# EAGLE design CoolRoof_Terminal_exterieur (EAGLE 9.5.2)
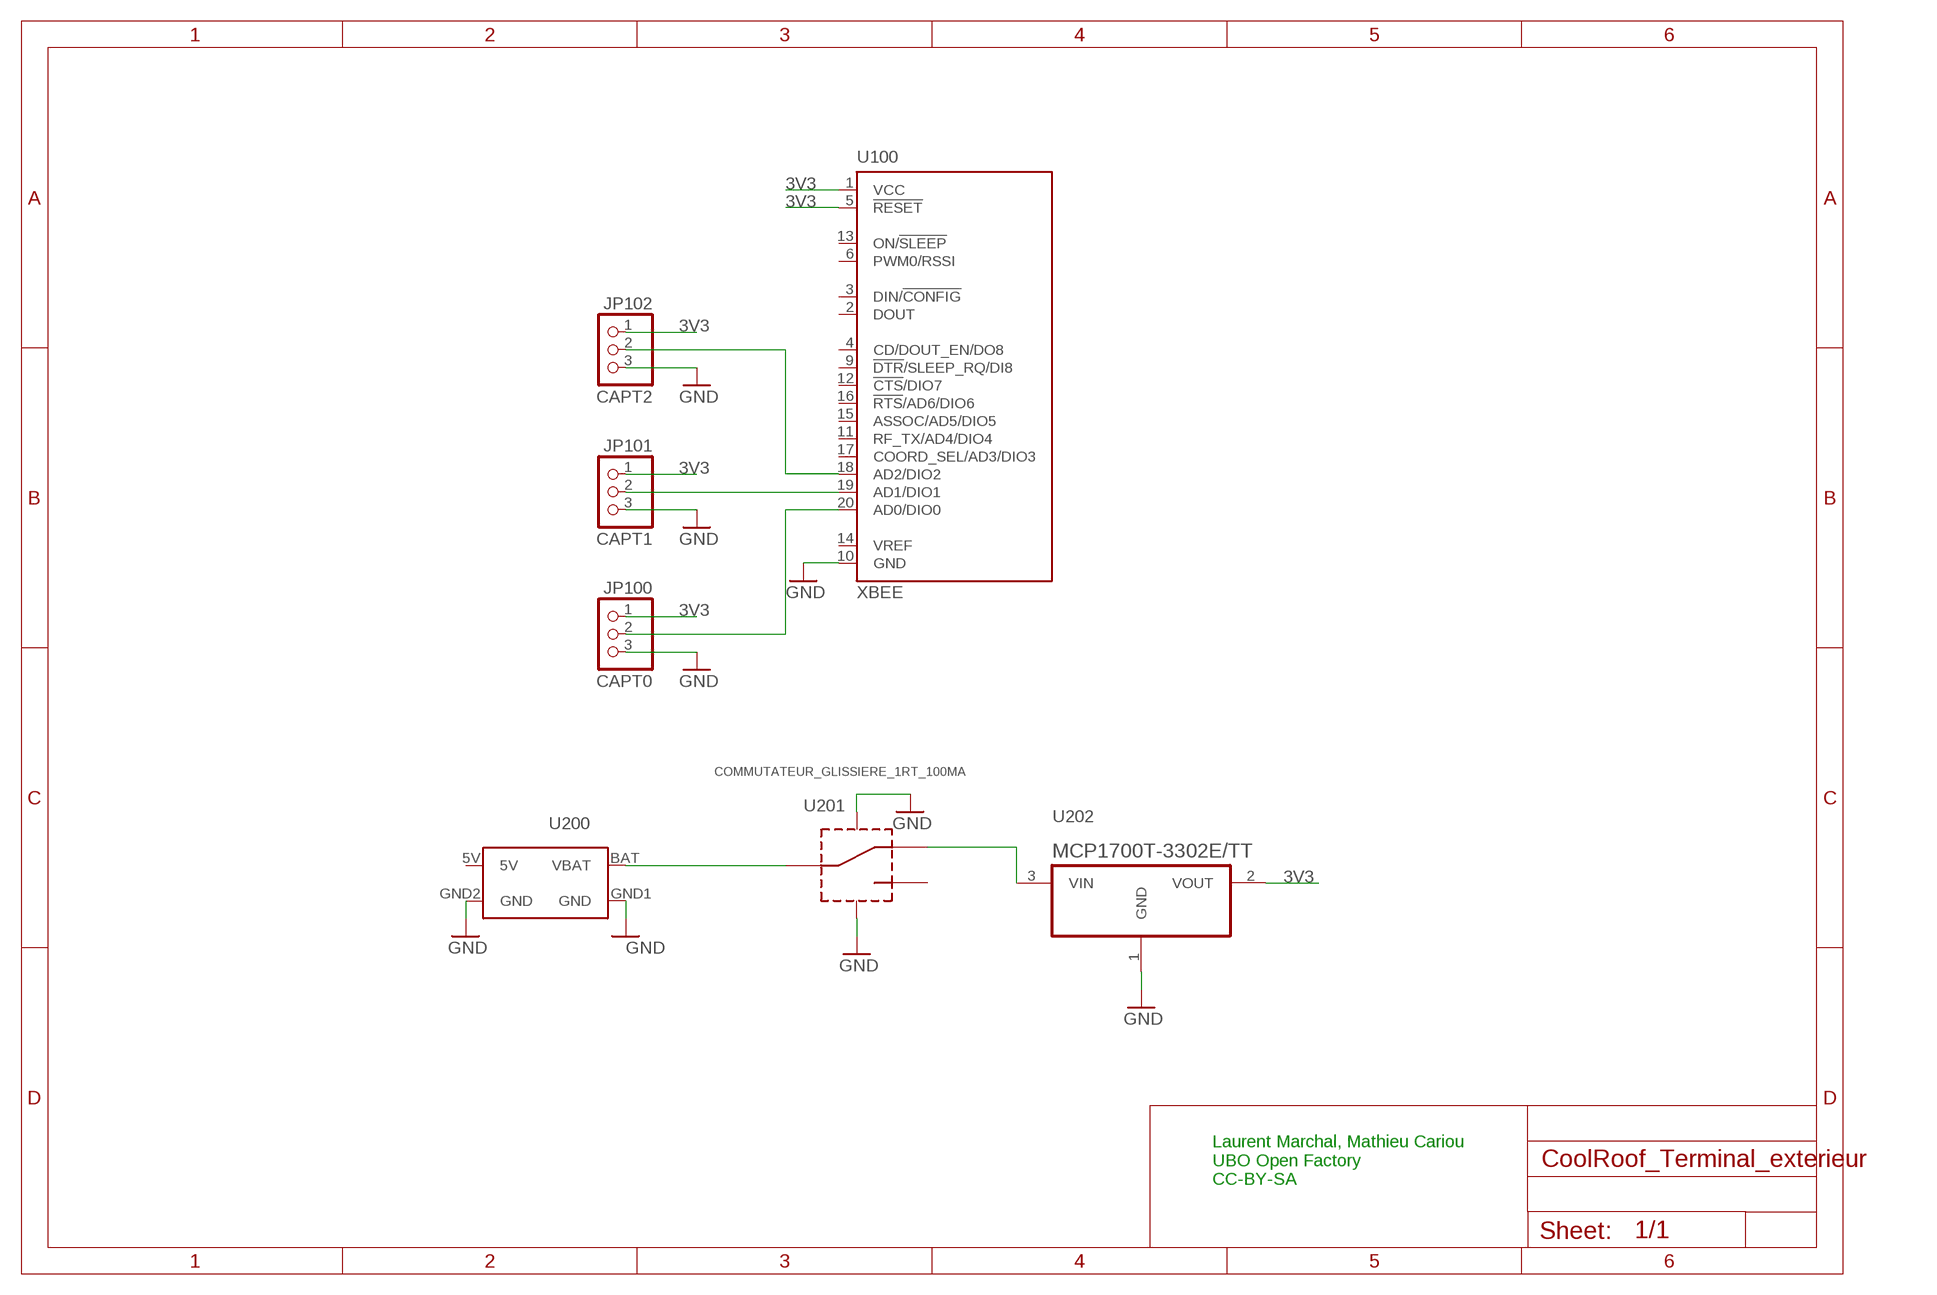
[diagram p0: schematic, sheet 1]

## Parts
JP100  CAPT0  PINHD-1X3  [1X03]
JP101  CAPT1  PINHD-1X3  [1X03]
JP102  CAPT2  PINHD-1X3  [1X03]
U100  XBEE  [XBEE]
U200  MICROUSB-LIPO-CHARGEUR-ADAFRUITMICRO-USB-CHARGEUR  [MICROUSB-LIPO-CHARGEUR-ADAFRUIT]
U201  COMMUTATEUR_GLISSIERE_1RT_100MA  [COMMUTATEUR_GLISSIERE_1RT_100MA]
U202  MCP1700T-3302E/TT  [SOT95P237X112-3N]

## Nets
3V3: JP100.1 JP101.1 JP102.1 U100.1(VCC) U100.5(!RESET) U202.2(VOUT)
GND: JP100.3 JP101.3 JP102.3 U100.10(GND) U200.GND1(GND) U200.GND2(GND) U201.GNDA U201.GNDB U202.1(GND)
N$1: JP100.2 U100.20(AD0/DIO0)
N$2: U200.BAT(VBAT) U201.COM
N$3: U201.OUTB(OUT2) U202.3(VIN)
N$7: JP101.2 U100.19(AD1/DIO1)
N$9: JP102.2 U100.18(AD2/DIO2)
Unconnected: U100.2(DOUT) U100.3(DIN/!CONFIG) U100.4(CD/DOUT_EN/DO8) U100.6(PWM0/RSSI) U100.9(!DTR!/SLEEP_RQ/DI8) U100.11(RF_TX/AD4/DIO4) U100.12(!CTS!/DIO7) U100.13(ON/!SLEEP) U100.14(VREF) U100.15(ASSOC/AD5/DIO5) U100.16(!RTS!/AD6/DIO6) U100.17(COORD_SEL/AD3/DIO3) U200.5V U201.OUTA(OUT1)

## Notes on the sheet
- Laurent Marchal, Mathieu Cariou
  UBO Open Factory
  CC-BY-SA

## Library data of the parts
JP100-JP102 = pinhead:PINHD-1X3: PIN HEADER
U100 = Eagle_UOF_Lib:XBEE: XBee (TM) /XBee-PRO(TM) OEM RF Modules Source: MaxStream, Inc. xbee_productmanual.pdf; MPN: XBP24-Z7UIT-004; OC_FARNELL: 1751799; OC_NEWARK: 34R5507
U200 = Eagle_UOF_Lib:MICROUSB-LIPO-CHARGEUR-ADAFRUIT
U201 = Eagle_UOF_Lib:COMMUTATEUR_GLISSIERE_1RT_100MA
U202 = Eagle_UOF_Lib:MCP1700T-3302E/TT: Check prices <https://pricing.snapeda.com/parts/MCP1700T-3302E/TT/Microchip%20Technology/view-part?ref=eda>; AVAILABILITY: In Stock; DESCRIPTION: Linear Voltage Regulator IC Positive Fixed 1 Output 250mA SOT-23-3; MF: Microchip Technology; MP: MCP1700T-3302E/TT; PACKAGE: None; PRICE: None

## Board
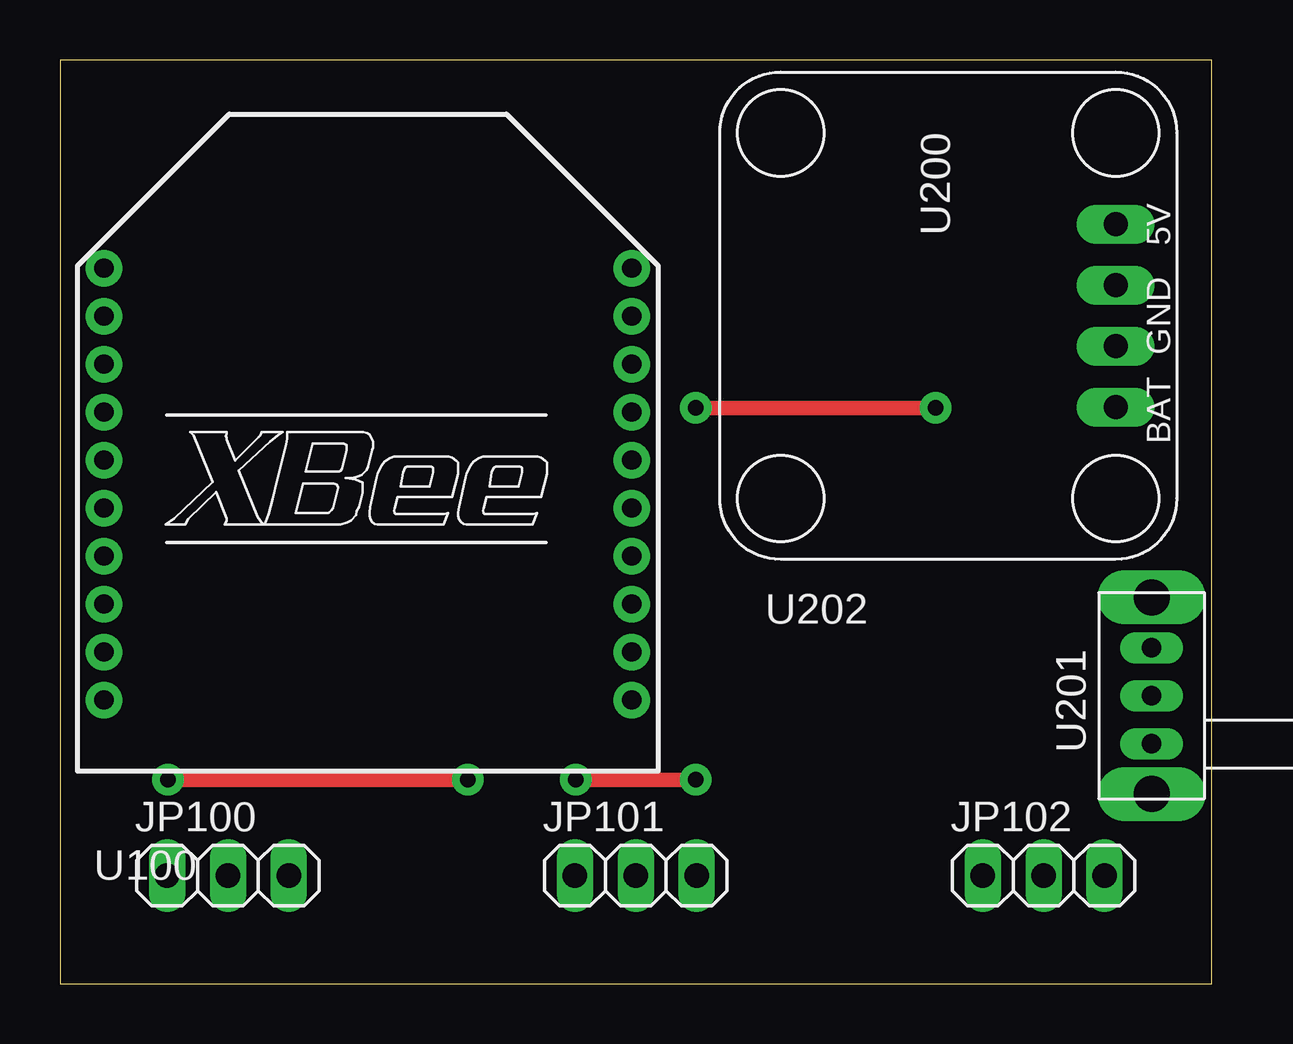
[diagram p1: board, top side]
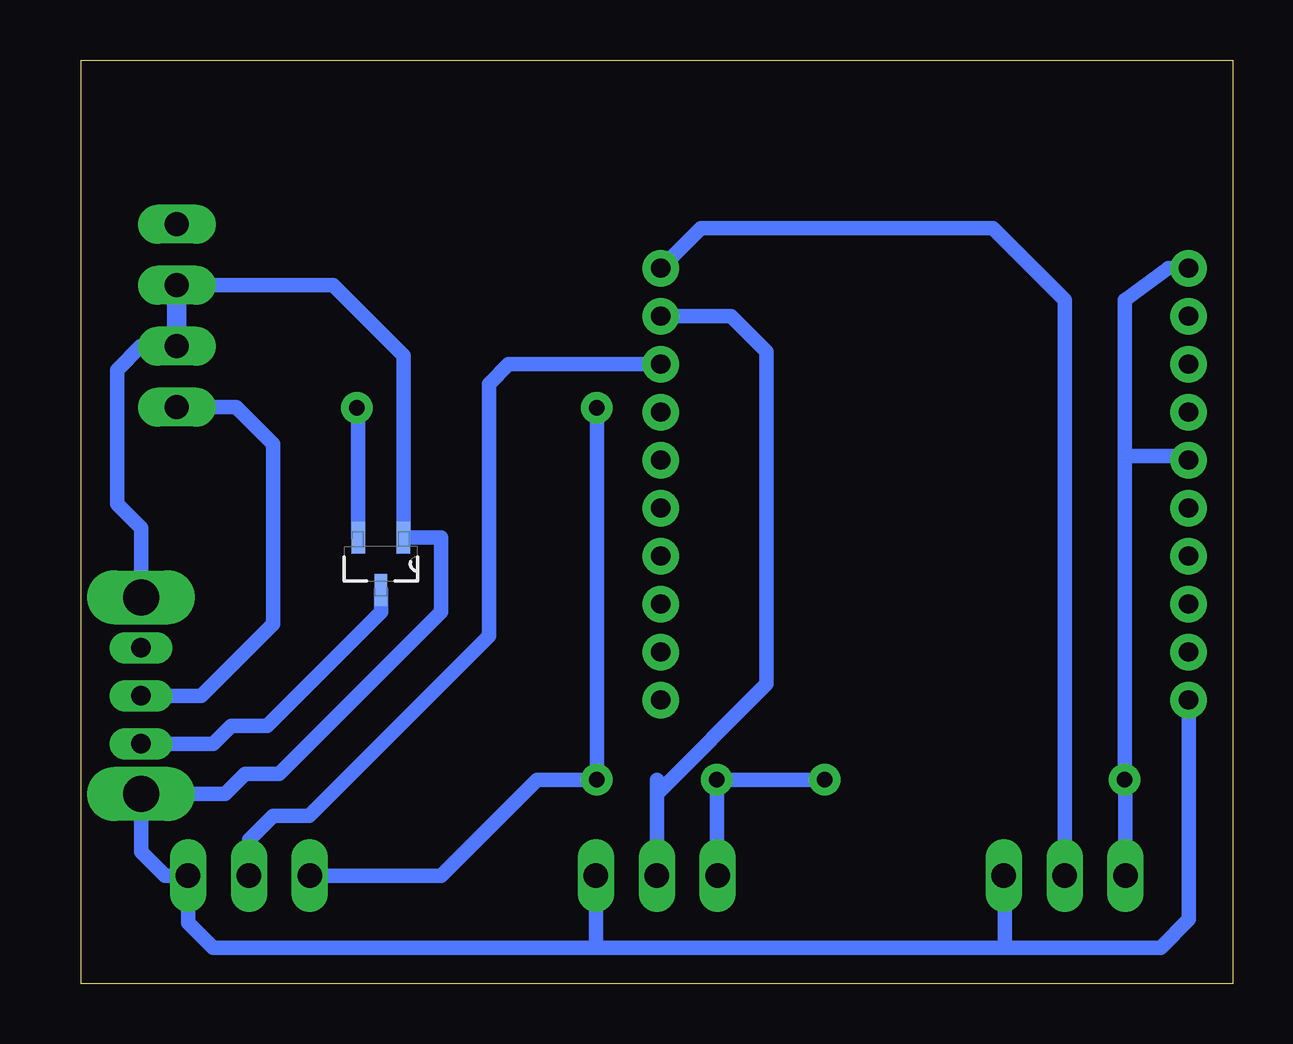
[diagram p2: board, bottom side, seen from below]

Size 48 x 38.5 mm. Coordinates in mm from the lower left corner, seen from the top.
Outline: 0,0 48,0 48,38.5 0,38.5 0,0
Copper layers (1*16): Top 0.035mm / dielectric 1.5mm / Bottom 0.035mm
Design rules "default": minimum track width 6mil, minimum drill 0.35mm, track to track 6mil, track to pad 6mil, pad to pad 6mil, via to via 6mil, smd to smd 6mil, copper to edge 40mil, drill to drill 6mil, minimum pad ring 10mil, minimum via ring 8mil, stop-mask expansion 4mil, vias tented up to drill 0mil, thermal gap 10mil

### Footprints (pad centres in the part's own frame; a part is rotated, then mirrored left to right if it is on the bottom)
1X03 = drill 1.016 long: 1 -2.54,0; 2 0,0; 3 2.54,0
XBEE = drill 0.8 pad 1.524: 1 -11,9; 2 -11,7; 3 -11,5; 4 -11,3; 5 -11,1; 6 -11,-1; 7 -11,-3; 8 -11,-5; 9 -11,-7; 10 -11,-9; 11 11,-9; 12 11,-7; 13 11,-5; 14 11,-3; 15 11,-1; 16 11,1; 17 11,3; 18 11,5; 19 11,7; 20 11,9
MICROUSB-LIPO-CHARGEUR-ADAFRUIT = drill 1 pad 1.626 long: 5V 6.35,16.51; BAT 13.97,16.51; GND1 8.89,16.51; GND2 11.43,16.51
COMMUTATEUR_GLISSIERE_1RT_100MA = drill 0.8 long: COM 0,0; OUTA 0,2; OUTB 0,-2 | drill 1.5 long: GNDA 0,4.1; GNDB 0,-4.1
SOT95P237X112-3N = smd 1.321 x 0.559: 1 -1.092,0.94; 2 -1.092,-0.94 | smd 1.321 x 0.508: 3 1.092,0

### Placement (x,y rotation side)
JP100  7,4.5 0 top
JP101  24,4.5 0 top
JP102  41,4.5 0 top
U100  12.83,20.82 0 top
U200  27.5,38 270 top
U201  45.5,12 0 top
U202  35.5,17.5 270 bottom

### Tracks (layer width: path | path; a pad name or v marks a point on that pad's centre or on a via)
3V3  (via drill 0.65 pad 1.3)
  Top 0.61: v26.5,8.5 v21.5,8.5 | v17,8.5 v4.5,8.5 | v36.5,24 v26.5,24
  Bottom 0.61: JP102.1 33,4.5 29,8.5 v26.5,8.5 v26.5,24 | JP101.1 21.5,4.54 v21.5,8.5 v17,8.5 | JP100.1 4.46,7.54 v4.5,8.5 4.5,22 | 4.5,22 2.01,22 U100.5 | 4.5,22 4.5,28.5 2.68,29.82 U100.1 | U202.2 36.44,23.94 v36.5,24
GND
  Bottom 0.61: U100.10 1.83,2.67 3,1.5 9.5,1.5 | 9.5,1.5 9.5,4.46 JP100.3 | 9.5,1.5 26.5,1.5 | 26.5,1.5 26.54,1.54 JP101.3 | 26.5,1.5 42.5,1.5 43.54,2.54 JP102.3 44.5,4.5 45.5,5.5 U201.GNDB 42,7.9 41.15,8.75 39.75,8.75 33,15.5 33,18.59 U202.1 34.56,26.17 37.5,29.11 U200.GND1 | U201.GNDA 45.5,19 46.5,20 46.5,25.58 45.51,26.57 U200.GND2
  Bottom 0.813: U200.GND2 U200.GND1
N$1
  Bottom 0.61: U100.20 22.15,31.5 10,31.5 7,28.5 JP100.2
N$2
  Bottom 0.61: U201.COM 43,12 40,15 40,22.5 41.53,24.03 U200.BAT
N$3
  Bottom 0.61: U201.OUTB 42.5,10 41.75,10.75 40.25,10.75 35.5,15.5 U202.3
N$7
  Bottom 0.61: 24,8.5 JP101.2 24,7.92 19.43,12.48 19.43,26.34 20.91,27.82 U100.19
N$9
  Bottom 0.61: U100.18 30.18,25.82 31,25 31,14.5 38.5,7 40,7 41,6 JP102.2